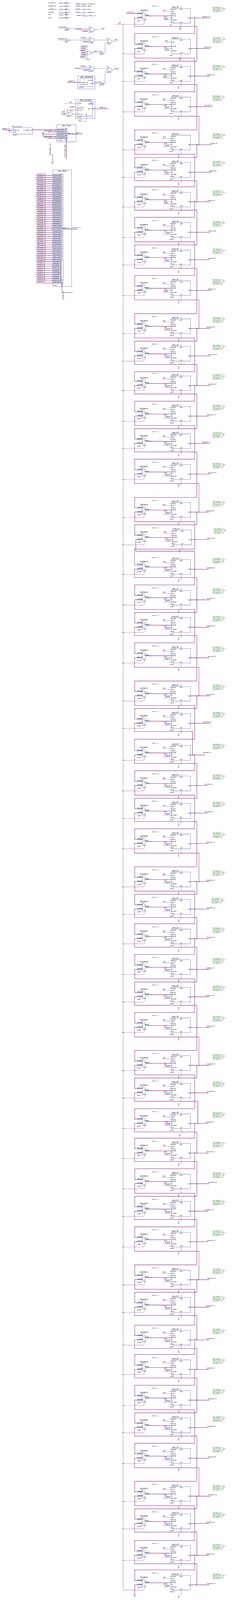
[diagram p0: schematic sheet, whole]
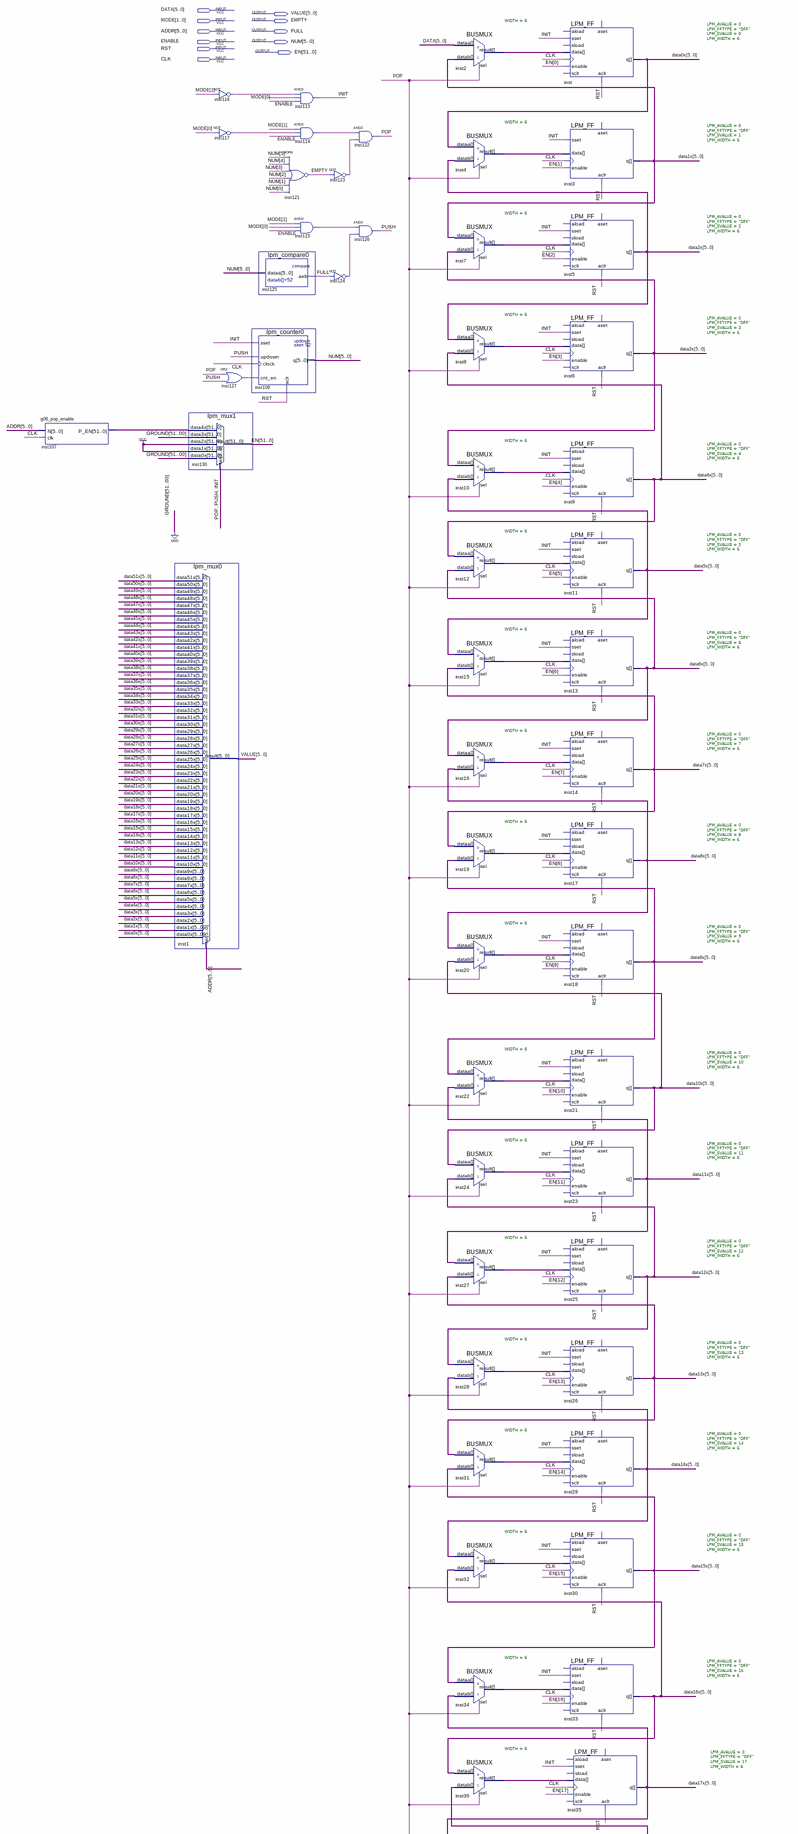
[diagram p1: schematic sheet, upper part]
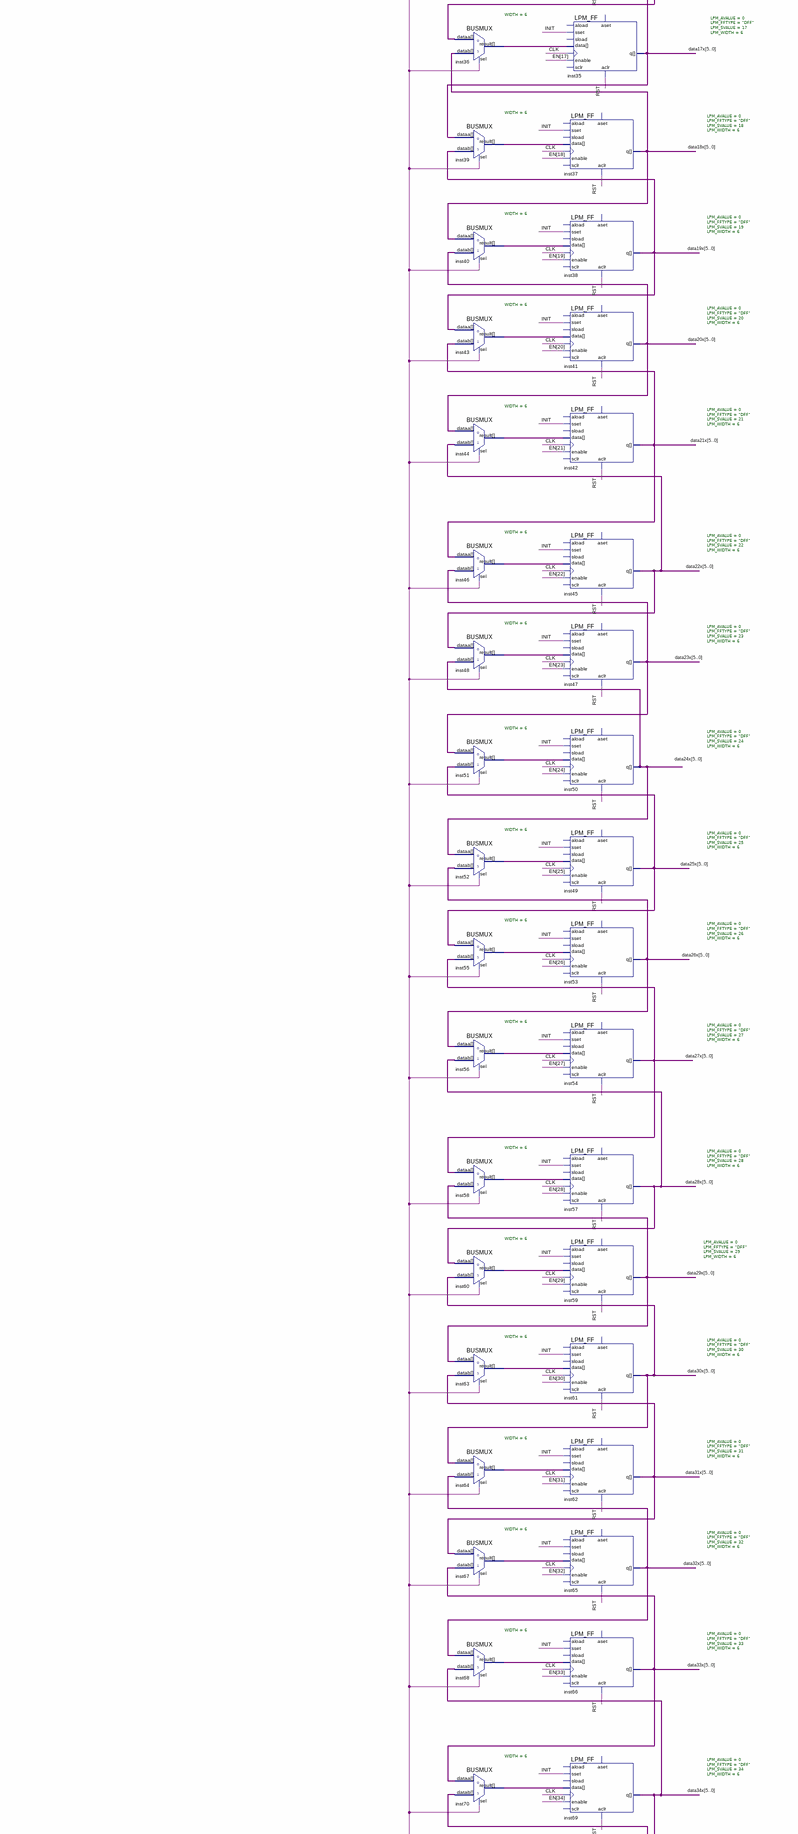
[diagram p2: schematic sheet, middle part]
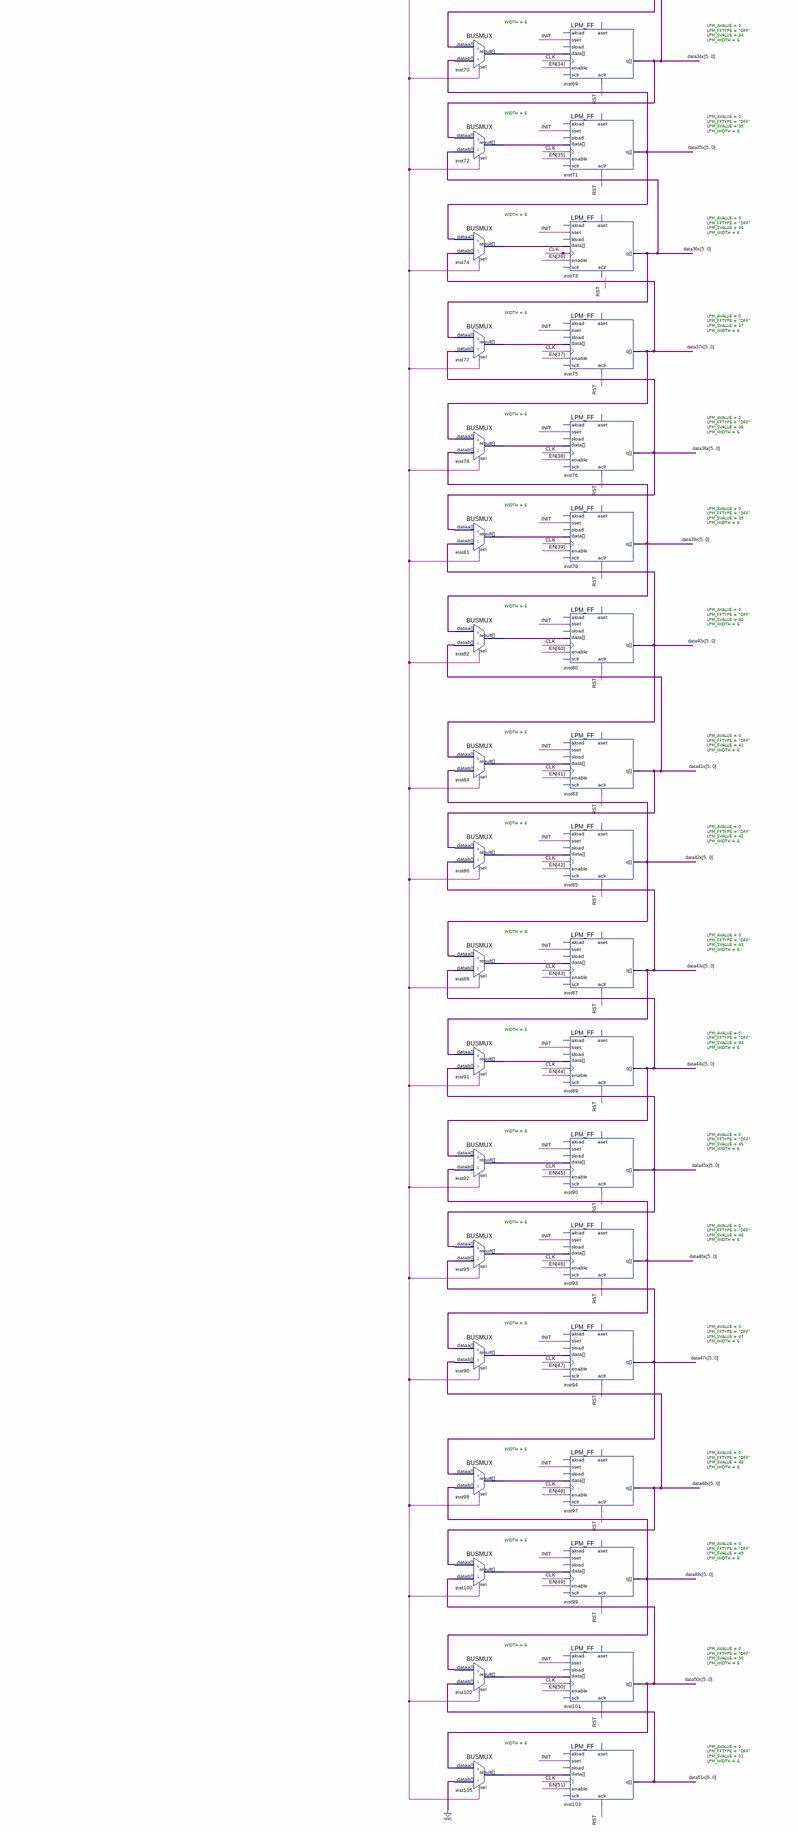
[diagram p3: schematic sheet, lower part]
// Quartus schematic g08_stack52.bdf as structural Verilog: 120 symbols, 11 pins
module g08_stack52 (
  input  [5:0] DATA,
  input  [1:0] MODE,
  input  [5:0] ADDR,
  input  ENABLE,
  input  RST,
  input  CLK,
  output [5:0] VALUE,
  output EMPTY,
  output FULL,
  output [5:0] NUM,
  output [51:0] EN
);

  wire INIT, inst114_out, inst115_out, inst117_out, inst118_out, inst123_out, inst124_out, inst127_out, POP,
       PUSH;
  wire [5:0] data0x, data1x, data2x, data3x, data4x, data5x, data6x, data7x, data8x, data9x, data10x,
       data11x, data12x, data13x, data14x, data15x, data16x, data17x, data18x, data19x, data20x, data21x,
       data22x, data23x, data24x, data25x, data26x, data27x, data28x, data29x, data30x, data31x, data32x,
       data33x, data34x, data35x, data36x, data37x, data38x, data39x, data40x, data41x, data42x, data43x,
       data44x, data45x, data46x, data47x, data48x, data49x, data50x, data51x, inst2_result, inst4_result,
       inst7_result, inst8_result, inst10_result, inst12_result, inst15_result, inst16_result, inst19_result,
       inst20_result, inst22_result, inst24_result, inst27_result, inst28_result, inst31_result,
       inst32_result, inst34_result, inst36_result, inst39_result, inst40_result, inst43_result,
       inst44_result, inst46_result, inst48_result, inst51_result, inst52_result, inst55_result,
       inst56_result, inst58_result, inst60_result, inst63_result, inst64_result, inst67_result,
       inst68_result, inst70_result, inst72_result, inst74_result, inst77_result, inst78_result,
       inst81_result, inst82_result, inst84_result, inst86_result, inst88_result, inst91_result,
       inst92_result, inst95_result, inst96_result, inst98_result, inst100_result, inst102_result,
       inst105_result;
  wire [51:0] inst107_p_en;

  g08_pop_enable inst107 (.N(ADDR), .clk(CLK), .P_EN(inst107_p_en));
  lpm_mux0 inst1 (
    .data51x(data51x), .data50x(data50x), .data49x(data49x), .data48x(data48x), .data47x(data47x),
    .data46x(data46x), .data45x(data45x), .data44x(data44x), .data43x(data43x), .data42x(data42x),
    .data41x(data41x), .data40x(data40x), .data39x(data39x), .data38x(data38x), .data37x(data37x),
    .data36x(data36x), .data35x(data35x), .data34x(data34x), .data33x(data33x), .data32x(data32x),
    .data31x(data31x), .data30x(data30x), .data29x(data29x), .data28x(data28x), .data27x(data27x),
    .data26x(data26x), .data25x(data25x), .data24x(data24x), .data23x(data23x), .data22x(data22x),
    .data21x(data21x), .data20x(data20x), .data19x(data19x), .data18x(data18x), .data17x(data17x),
    .data16x(data16x), .data15x(data15x), .data14x(data14x), .data13x(data13x), .data12x(data12x),
    .data11x(data11x), .data10x(data10x), .data9x(data9x), .data8x(data8x), .data7x(data7x), .data6x(data6x),
    .data5x(data5x), .data4x(data4x), .data3x(data3x), .data2x(data2x), .data1x(data1x), .data0x(data0x),
    .sel(ADDR), .result(VALUE));
  lpm_mux1 inst130 (
    .data4x(inst107_p_en), .data3x({52{1'b0}}), .data2x({52{1'b1}}), .data1x({52{1'b1}}),
    .data0x({52{1'b0}}), .sel({POP, PUSH, INIT}), .result(EN));
  not inst118 (inst118_out, MODE[1]);
  not inst117 (inst117_out, MODE[0]);
  or inst127 (inst127_out, POP, PUSH);
  lpm_compare0 inst125 (.dataa(NUM), .aeb(FULL));
  lpm_counter0 inst108 (.sset(INIT), .updown(PUSH), .clock(CLK), .cnt_en(inst127_out), .aclr(RST), .q(NUM));
  nor inst121 (EMPTY, NUM[5], NUM[4], NUM[3], NUM[2], NUM[1], NUM[0]);
  and inst113 (INIT, inst118_out, MODE[0], ENABLE);
  and inst114 (inst114_out, MODE[1], inst117_out, ENABLE);
  and inst115 (inst115_out, MODE[1], MODE[0], ENABLE);
  not inst123 (inst123_out, EMPTY);
  not inst124 (inst124_out, FULL);
  and inst122 (POP, inst114_out, inst123_out);
  and inst126 (PUSH, inst115_out, inst124_out);
  BUSMUX #(.WIDTH(6)) inst2 (.datab(data1x), .sel(POP), .dataa(DATA), .result(inst2_result));
  BUSMUX #(.WIDTH(6)) inst4 (.datab(data2x), .sel(POP), .dataa(data0x), .result(inst4_result));
  BUSMUX #(.WIDTH(6)) inst7 (.datab(data3x), .sel(POP), .dataa(data1x), .result(inst7_result));
  BUSMUX #(.WIDTH(6)) inst8 (.datab(data4x), .sel(POP), .dataa(data2x), .result(inst8_result));
  BUSMUX #(.WIDTH(6)) inst10 (.datab(data5x), .sel(POP), .dataa(data3x), .result(inst10_result));
  BUSMUX #(.WIDTH(6)) inst12 (.datab(data6x), .sel(POP), .dataa(data4x), .result(inst12_result));
  BUSMUX #(.WIDTH(6)) inst15 (.datab(data7x), .sel(POP), .dataa(data5x), .result(inst15_result));
  BUSMUX #(.WIDTH(6)) inst16 (.datab(data8x), .sel(POP), .dataa(data6x), .result(inst16_result));
  BUSMUX #(.WIDTH(6)) inst19 (.datab(data9x), .sel(POP), .dataa(data7x), .result(inst19_result));
  BUSMUX #(.WIDTH(6)) inst20 (.datab(data10x), .sel(POP), .dataa(data8x), .result(inst20_result));
  BUSMUX #(.WIDTH(6)) inst22 (.datab(data11x), .sel(POP), .dataa(data9x), .result(inst22_result));
  BUSMUX #(.WIDTH(6)) inst24 (.datab(data12x), .sel(POP), .dataa(data10x), .result(inst24_result));
  BUSMUX #(.WIDTH(6)) inst27 (.datab(data13x), .sel(POP), .dataa(data11x), .result(inst27_result));
  BUSMUX #(.WIDTH(6)) inst28 (.datab(data14x), .sel(POP), .dataa(data12x), .result(inst28_result));
  BUSMUX #(.WIDTH(6)) inst31 (.datab(data15x), .sel(POP), .dataa(data13x), .result(inst31_result));
  BUSMUX #(.WIDTH(6)) inst32 (.datab(data16x), .sel(POP), .dataa(data14x), .result(inst32_result));
  BUSMUX #(.WIDTH(6)) inst34 (.datab(data17x), .sel(POP), .dataa(data15x), .result(inst34_result));
  BUSMUX #(.WIDTH(6)) inst36 (.datab(data18x), .sel(POP), .dataa(data16x), .result(inst36_result));
  BUSMUX #(.WIDTH(6)) inst39 (.datab(data19x), .sel(POP), .dataa(data17x), .result(inst39_result));
  BUSMUX #(.WIDTH(6)) inst40 (.datab(data20x), .sel(POP), .dataa(data18x), .result(inst40_result));
  BUSMUX #(.WIDTH(6)) inst43 (.datab(data21x), .sel(POP), .dataa(data19x), .result(inst43_result));
  BUSMUX #(.WIDTH(6)) inst44 (.datab(data22x), .sel(POP), .dataa(data20x), .result(inst44_result));
  BUSMUX #(.WIDTH(6)) inst46 (.datab(data23x), .sel(POP), .dataa(data21x), .result(inst46_result));
  BUSMUX #(.WIDTH(6)) inst48 (.datab(data24x), .sel(POP), .dataa(data22x), .result(inst48_result));
  BUSMUX #(.WIDTH(6)) inst51 (.datab(data25x), .sel(POP), .dataa(data23x), .result(inst51_result));
  BUSMUX #(.WIDTH(6)) inst52 (.datab(data26x), .sel(POP), .dataa(data24x), .result(inst52_result));
  BUSMUX #(.WIDTH(6)) inst55 (.datab(data27x), .sel(POP), .dataa(data25x), .result(inst55_result));
  BUSMUX #(.WIDTH(6)) inst56 (.datab(data28x), .sel(POP), .dataa(data26x), .result(inst56_result));
  BUSMUX #(.WIDTH(6)) inst58 (.datab(data29x), .sel(POP), .dataa(data27x), .result(inst58_result));
  BUSMUX #(.WIDTH(6)) inst60 (.datab(data30x), .sel(POP), .dataa(data28x), .result(inst60_result));
  BUSMUX #(.WIDTH(6)) inst63 (.datab(data31x), .sel(POP), .dataa(data29x), .result(inst63_result));
  BUSMUX #(.WIDTH(6)) inst64 (.datab(data32x), .sel(POP), .dataa(data30x), .result(inst64_result));
  BUSMUX #(.WIDTH(6)) inst67 (.datab(data33x), .sel(POP), .dataa(data31x), .result(inst67_result));
  BUSMUX #(.WIDTH(6)) inst68 (.datab(data34x), .sel(POP), .dataa(data32x), .result(inst68_result));
  BUSMUX #(.WIDTH(6)) inst70 (.datab(data35x), .sel(POP), .dataa(data33x), .result(inst70_result));
  BUSMUX #(.WIDTH(6)) inst72 (.datab(data36x), .sel(POP), .dataa(data34x), .result(inst72_result));
  BUSMUX #(.WIDTH(6)) inst74 (.datab(data37x), .sel(POP), .dataa(data35x), .result(inst74_result));
  BUSMUX #(.WIDTH(6)) inst77 (.datab(data38x), .sel(POP), .dataa(data36x), .result(inst77_result));
  BUSMUX #(.WIDTH(6)) inst78 (.datab(data39x), .sel(POP), .dataa(data37x), .result(inst78_result));
  BUSMUX #(.WIDTH(6)) inst81 (.datab(data40x), .sel(POP), .dataa(data38x), .result(inst81_result));
  BUSMUX #(.WIDTH(6)) inst82 (.datab(data41x), .sel(POP), .dataa(data39x), .result(inst82_result));
  BUSMUX #(.WIDTH(6)) inst84 (.datab(data42x), .sel(POP), .dataa(data40x), .result(inst84_result));
  BUSMUX #(.WIDTH(6)) inst86 (.datab(data43x), .sel(POP), .dataa(data41x), .result(inst86_result));
  BUSMUX #(.WIDTH(6)) inst88 (.datab(data44x), .sel(POP), .dataa(data42x), .result(inst88_result));
  BUSMUX #(.WIDTH(6)) inst91 (.datab(data45x), .sel(POP), .dataa(data43x), .result(inst91_result));
  BUSMUX #(.WIDTH(6)) inst92 (.datab(data46x), .sel(POP), .dataa(data44x), .result(inst92_result));
  BUSMUX #(.WIDTH(6)) inst95 (.datab(data47x), .sel(POP), .dataa(data45x), .result(inst95_result));
  BUSMUX #(.WIDTH(6)) inst96 (.datab(data48x), .sel(POP), .dataa(data46x), .result(inst96_result));
  BUSMUX #(.WIDTH(6)) inst98 (.datab(data49x), .sel(POP), .dataa(data47x), .result(inst98_result));
  BUSMUX #(.WIDTH(6)) inst100 (.datab(data50x), .sel(POP), .dataa(data48x), .result(inst100_result));
  BUSMUX #(.WIDTH(6)) inst102 (.datab(data51x), .sel(POP), .dataa(data49x), .result(inst102_result));
  BUSMUX #(.WIDTH(6)) inst105 (.datab({6{1'b0}}), .sel(POP), .dataa(data50x), .result(inst105_result));
  LPM_FF #(.LPM_AVALUE(0), .LPM_FFTYPE("DFF"), .LPM_SVALUE(0), .LPM_WIDTH(6)) inst (
    .enable(EN[0]), .clock(CLK), .sset(INIT), .aclr(RST), .data(inst2_result), .q(data0x));  // open: aload, sload, aset, sclr
  LPM_FF #(.LPM_AVALUE(0), .LPM_FFTYPE("DFF"), .LPM_SVALUE(1), .LPM_WIDTH(6)) inst3 (
    .aclr(RST), .clock(CLK), .data(inst4_result), .enable(EN[1]), .sset(INIT), .q(data1x));  // open: aset
  LPM_FF #(.LPM_AVALUE(0), .LPM_FFTYPE("DFF"), .LPM_SVALUE(2), .LPM_WIDTH(6)) inst5 (
    .enable(EN[2]), .clock(CLK), .sset(INIT), .aclr(RST), .data(inst7_result), .q(data2x));  // open: aload, sload, aset, sclr
  LPM_FF #(.LPM_AVALUE(0), .LPM_FFTYPE("DFF"), .LPM_SVALUE(3), .LPM_WIDTH(6)) inst6 (
    .enable(EN[3]), .clock(CLK), .sset(INIT), .aclr(RST), .data(inst8_result), .q(data3x));  // open: aload, sload, aset, sclr
  LPM_FF #(.LPM_AVALUE(0), .LPM_FFTYPE("DFF"), .LPM_SVALUE(4), .LPM_WIDTH(6)) inst9 (
    .aclr(RST), .clock(CLK), .data(inst10_result), .enable(EN[4]), .sset(INIT), .q(data4x));  // open: aload, sclr, sload
  LPM_FF #(.LPM_AVALUE(0), .LPM_FFTYPE("DFF"), .LPM_SVALUE(5), .LPM_WIDTH(6)) inst11 (
    .enable(EN[5]), .clock(CLK), .sset(INIT), .aclr(RST), .data(inst12_result), .q(data5x));  // open: aload, sload, aset, sclr
  LPM_FF #(.LPM_AVALUE(0), .LPM_FFTYPE("DFF"), .LPM_SVALUE(6), .LPM_WIDTH(6)) inst13 (
    .enable(EN[6]), .clock(CLK), .sset(INIT), .aclr(RST), .data(inst15_result), .q(data6x));  // open: aload, sload, aset, sclr
  LPM_FF #(.LPM_AVALUE(0), .LPM_FFTYPE("DFF"), .LPM_SVALUE(7), .LPM_WIDTH(6)) inst14 (
    .enable(EN[7]), .clock(CLK), .sset(INIT), .aclr(RST), .data(inst16_result), .q(data7x));  // open: aload, sload, aset, sclr
  LPM_FF #(.LPM_AVALUE(0), .LPM_FFTYPE("DFF"), .LPM_SVALUE(8), .LPM_WIDTH(6)) inst17 (
    .enable(EN[8]), .clock(CLK), .sset(INIT), .aclr(RST), .data(inst19_result), .q(data8x));  // open: aload, sload, aset, sclr
  LPM_FF #(.LPM_AVALUE(0), .LPM_FFTYPE("DFF"), .LPM_SVALUE(9), .LPM_WIDTH(6)) inst18 (
    .enable(EN[9]), .clock(CLK), .sset(INIT), .aclr(RST), .data(inst20_result), .q(data9x));  // open: aload, sload, aset, sclr
  LPM_FF #(.LPM_AVALUE(0), .LPM_FFTYPE("DFF"), .LPM_SVALUE(10), .LPM_WIDTH(6)) inst21 (
    .enable(EN[10]), .clock(CLK), .sset(INIT), .aclr(RST), .data(inst22_result), .q(data10x));  // open: aload, sload, aset, sclr
  LPM_FF #(.LPM_AVALUE(0), .LPM_FFTYPE("DFF"), .LPM_SVALUE(11), .LPM_WIDTH(6)) inst23 (
    .enable(EN[11]), .clock(CLK), .sset(INIT), .aclr(RST), .data(inst24_result), .q(data11x));  // open: aload, sload, aset, sclr
  LPM_FF #(.LPM_AVALUE(0), .LPM_FFTYPE("DFF"), .LPM_SVALUE(12), .LPM_WIDTH(6)) inst25 (
    .enable(EN[12]), .clock(CLK), .sset(INIT), .aclr(RST), .data(inst27_result), .q(data12x));  // open: aload, sload, aset, sclr
  LPM_FF #(.LPM_AVALUE(0), .LPM_FFTYPE("DFF"), .LPM_SVALUE(13), .LPM_WIDTH(6)) inst26 (
    .enable(EN[13]), .clock(CLK), .sset(INIT), .aclr(RST), .data(inst28_result), .q(data13x));  // open: aload, sload, aset, sclr
  LPM_FF #(.LPM_AVALUE(0), .LPM_FFTYPE("DFF"), .LPM_SVALUE(14), .LPM_WIDTH(6)) inst29 (
    .enable(EN[14]), .clock(CLK), .sset(INIT), .aclr(RST), .data(inst31_result), .q(data14x));  // open: aload, sload, aset, sclr
  LPM_FF #(.LPM_AVALUE(0), .LPM_FFTYPE("DFF"), .LPM_SVALUE(15), .LPM_WIDTH(6)) inst30 (
    .enable(EN[15]), .clock(CLK), .sset(INIT), .aclr(RST), .data(inst32_result), .q(data15x));  // open: aload, sload, aset, sclr
  LPM_FF #(.LPM_AVALUE(0), .LPM_FFTYPE("DFF"), .LPM_SVALUE(16), .LPM_WIDTH(6)) inst33 (
    .enable(EN[16]), .clock(CLK), .sset(INIT), .aclr(RST), .data(inst34_result), .q(data16x));  // open: aload, sload, aset, sclr
  LPM_FF #(.LPM_AVALUE(0), .LPM_FFTYPE("DFF"), .LPM_SVALUE(17), .LPM_WIDTH(6)) inst35 (
    .enable(EN[17]), .clock(CLK), .sset(INIT), .aclr(RST), .data(inst36_result), .q(data17x));  // open: aload, sload, aset, sclr
  LPM_FF #(.LPM_AVALUE(0), .LPM_FFTYPE("DFF"), .LPM_SVALUE(18), .LPM_WIDTH(6)) inst37 (
    .enable(EN[18]), .clock(CLK), .sset(INIT), .aclr(RST), .data(inst39_result), .q(data18x));  // open: aload, sload, aset, sclr
  LPM_FF #(.LPM_AVALUE(0), .LPM_FFTYPE("DFF"), .LPM_SVALUE(19), .LPM_WIDTH(6)) inst38 (
    .enable(EN[19]), .clock(CLK), .sset(INIT), .aclr(RST), .data(inst40_result), .q(data19x));  // open: aload, sload, aset, sclr
  LPM_FF #(.LPM_AVALUE(0), .LPM_FFTYPE("DFF"), .LPM_SVALUE(20), .LPM_WIDTH(6)) inst41 (
    .enable(EN[20]), .clock(CLK), .sset(INIT), .aclr(RST), .data(inst43_result), .q(data20x));  // open: aload, sload, aset, sclr
  LPM_FF #(.LPM_AVALUE(0), .LPM_FFTYPE("DFF"), .LPM_SVALUE(21), .LPM_WIDTH(6)) inst42 (
    .enable(EN[21]), .clock(CLK), .sset(INIT), .aclr(RST), .data(inst44_result), .q(data21x));  // open: aload, sload, aset, sclr
  LPM_FF #(.LPM_AVALUE(0), .LPM_FFTYPE("DFF"), .LPM_SVALUE(22), .LPM_WIDTH(6)) inst45 (
    .enable(EN[22]), .clock(CLK), .sset(INIT), .aclr(RST), .data(inst46_result), .q(data22x));  // open: aload, sload, aset, sclr
  LPM_FF #(.LPM_AVALUE(0), .LPM_FFTYPE("DFF"), .LPM_SVALUE(23), .LPM_WIDTH(6)) inst47 (
    .enable(EN[23]), .clock(CLK), .sset(INIT), .aclr(RST), .data(inst48_result), .q(data23x));  // open: aload, sload, aset, sclr
  LPM_FF #(.LPM_AVALUE(0), .LPM_FFTYPE("DFF"), .LPM_SVALUE(24), .LPM_WIDTH(6)) inst50 (
    .enable(EN[24]), .clock(CLK), .sset(INIT), .aclr(RST), .data(inst51_result), .q(data24x));  // open: aload, sload, aset, sclr
  LPM_FF #(.LPM_AVALUE(0), .LPM_FFTYPE("DFF"), .LPM_SVALUE(25), .LPM_WIDTH(6)) inst49 (
    .enable(EN[25]), .clock(CLK), .sset(INIT), .aclr(RST), .data(inst52_result), .q(data25x));  // open: aload, sload, aset, sclr
  LPM_FF #(.LPM_AVALUE(0), .LPM_FFTYPE("DFF"), .LPM_SVALUE(26), .LPM_WIDTH(6)) inst53 (
    .enable(EN[26]), .clock(CLK), .sset(INIT), .aclr(RST), .data(inst55_result), .q(data26x));  // open: aload, sload, aset, sclr
  LPM_FF #(.LPM_AVALUE(0), .LPM_FFTYPE("DFF"), .LPM_SVALUE(27), .LPM_WIDTH(6)) inst54 (
    .enable(EN[27]), .clock(CLK), .sset(INIT), .aclr(RST), .data(inst56_result), .q(data27x));  // open: aload, sload, aset, sclr
  LPM_FF #(.LPM_AVALUE(0), .LPM_FFTYPE("DFF"), .LPM_SVALUE(28), .LPM_WIDTH(6)) inst57 (
    .enable(EN[28]), .clock(CLK), .sset(INIT), .aclr(RST), .data(inst58_result), .q(data28x));  // open: aload, sload, aset, sclr
  LPM_FF #(.LPM_AVALUE(0), .LPM_FFTYPE("DFF"), .LPM_SVALUE(29), .LPM_WIDTH(6)) inst59 (
    .enable(EN[29]), .clock(CLK), .sset(INIT), .aclr(RST), .data(inst60_result), .q(data29x));  // open: aload, sload, aset, sclr
  LPM_FF #(.LPM_AVALUE(0), .LPM_FFTYPE("DFF"), .LPM_SVALUE(30), .LPM_WIDTH(6)) inst61 (
    .enable(EN[30]), .clock(CLK), .sset(INIT), .aclr(RST), .data(inst63_result), .q(data30x));  // open: aload, sload, aset, sclr
  LPM_FF #(.LPM_AVALUE(0), .LPM_FFTYPE("DFF"), .LPM_SVALUE(31), .LPM_WIDTH(6)) inst62 (
    .enable(EN[31]), .clock(CLK), .sset(INIT), .aclr(RST), .data(inst64_result), .q(data31x));  // open: aload, sload, aset, sclr
  LPM_FF #(.LPM_AVALUE(0), .LPM_FFTYPE("DFF"), .LPM_SVALUE(32), .LPM_WIDTH(6)) inst65 (
    .enable(EN[32]), .clock(CLK), .sset(INIT), .aclr(RST), .data(inst67_result), .q(data32x));  // open: aload, sload, aset, sclr
  LPM_FF #(.LPM_AVALUE(0), .LPM_FFTYPE("DFF"), .LPM_SVALUE(33), .LPM_WIDTH(6)) inst66 (
    .enable(EN[33]), .clock(CLK), .sset(INIT), .aclr(RST), .data(inst68_result), .q(data33x));  // open: aload, sload, aset, sclr
  LPM_FF #(.LPM_AVALUE(0), .LPM_FFTYPE("DFF"), .LPM_SVALUE(34), .LPM_WIDTH(6)) inst69 (
    .enable(EN[34]), .clock(CLK), .sset(INIT), .aclr(RST), .data(inst70_result), .q(data34x));  // open: aload, sload, aset, sclr
  LPM_FF #(.LPM_AVALUE(0), .LPM_FFTYPE("DFF"), .LPM_SVALUE(35), .LPM_WIDTH(6)) inst71 (
    .enable(EN[35]), .clock(CLK), .sset(INIT), .aclr(RST), .data(inst72_result), .q(data35x));  // open: aload, sload, aset, sclr
  LPM_FF #(.LPM_AVALUE(0), .LPM_FFTYPE("DFF"), .LPM_SVALUE(36), .LPM_WIDTH(6)) inst73 (
    .enable(EN[36]), .clock(CLK), .sset(INIT), .data(inst74_result), .q(data36x));  // open: aload, sload, aset, sclr, aclr
  LPM_FF #(.LPM_AVALUE(0), .LPM_FFTYPE("DFF"), .LPM_SVALUE(37), .LPM_WIDTH(6)) inst75 (
    .enable(EN[37]), .clock(CLK), .sset(INIT), .aclr(RST), .data(inst77_result), .q(data37x));  // open: aload, sload, aset, sclr
  LPM_FF #(.LPM_AVALUE(0), .LPM_FFTYPE("DFF"), .LPM_SVALUE(38), .LPM_WIDTH(6)) inst76 (
    .enable(EN[38]), .clock(CLK), .sset(INIT), .aclr(RST), .data(inst78_result), .q(data38x));  // open: aload, sload, aset, sclr
  LPM_FF #(.LPM_AVALUE(0), .LPM_FFTYPE("DFF"), .LPM_SVALUE(39), .LPM_WIDTH(6)) inst79 (
    .enable(EN[39]), .clock(CLK), .sset(INIT), .aclr(RST), .data(inst81_result), .q(data39x));  // open: aload, sload, aset, sclr
  LPM_FF #(.LPM_AVALUE(0), .LPM_FFTYPE("DFF"), .LPM_SVALUE(40), .LPM_WIDTH(6)) inst80 (
    .enable(EN[40]), .clock(CLK), .sset(INIT), .aclr(RST), .data(inst82_result), .q(data40x));  // open: aload, sload, aset, sclr
  LPM_FF #(.LPM_AVALUE(0), .LPM_FFTYPE("DFF"), .LPM_SVALUE(41), .LPM_WIDTH(6)) inst83 (
    .enable(EN[41]), .clock(CLK), .sset(INIT), .aclr(RST), .data(inst84_result), .q(data41x));  // open: aload, sload, aset, sclr
  LPM_FF #(.LPM_AVALUE(0), .LPM_FFTYPE("DFF"), .LPM_SVALUE(42), .LPM_WIDTH(6)) inst85 (
    .enable(EN[42]), .clock(CLK), .sset(INIT), .aclr(RST), .data(inst86_result), .q(data42x));  // open: aload, sload, aset, sclr
  LPM_FF #(.LPM_AVALUE(0), .LPM_FFTYPE("DFF"), .LPM_SVALUE(43), .LPM_WIDTH(6)) inst87 (
    .enable(EN[43]), .clock(CLK), .sset(INIT), .aclr(RST), .data(inst88_result), .q(data43x));  // open: aload, sload, aset, sclr
  LPM_FF #(.LPM_AVALUE(0), .LPM_FFTYPE("DFF"), .LPM_SVALUE(44), .LPM_WIDTH(6)) inst89 (
    .enable(EN[44]), .clock(CLK), .sset(INIT), .aclr(RST), .data(inst91_result), .q(data44x));  // open: aload, sload, aset, sclr
  LPM_FF #(.LPM_AVALUE(0), .LPM_FFTYPE("DFF"), .LPM_SVALUE(45), .LPM_WIDTH(6)) inst90 (
    .enable(EN[45]), .clock(CLK), .sset(INIT), .aclr(RST), .data(inst92_result), .q(data45x));  // open: aload, sload, aset, sclr
  LPM_FF #(.LPM_AVALUE(0), .LPM_FFTYPE("DFF"), .LPM_SVALUE(46), .LPM_WIDTH(6)) inst93 (
    .enable(EN[46]), .clock(CLK), .sset(INIT), .aclr(RST), .data(inst95_result), .q(data46x));  // open: aload, sload, aset, sclr
  LPM_FF #(.LPM_AVALUE(0), .LPM_FFTYPE("DFF"), .LPM_SVALUE(47), .LPM_WIDTH(6)) inst94 (
    .enable(EN[47]), .clock(CLK), .sset(INIT), .aclr(RST), .data(inst96_result), .q(data47x));  // open: aload, sload, aset, sclr
  LPM_FF #(.LPM_AVALUE(0), .LPM_FFTYPE("DFF"), .LPM_SVALUE(48), .LPM_WIDTH(6)) inst97 (
    .enable(EN[48]), .clock(CLK), .sset(INIT), .aclr(RST), .data(inst98_result), .q(data48x));  // open: aload, sload, aset, sclr
  LPM_FF #(.LPM_AVALUE(0), .LPM_FFTYPE("DFF"), .LPM_SVALUE(49), .LPM_WIDTH(6)) inst99 (
    .enable(EN[49]), .clock(CLK), .sset(INIT), .aclr(RST), .data(inst100_result), .q(data49x));  // open: aload, sload, aset, sclr
  LPM_FF #(.LPM_AVALUE(0), .LPM_FFTYPE("DFF"), .LPM_SVALUE(50), .LPM_WIDTH(6)) inst101 (
    .enable(EN[50]), .clock(CLK), .sset(INIT), .aclr(RST), .data(inst102_result), .q(data50x));  // open: aload, sload, aset, sclr
  LPM_FF #(.LPM_AVALUE(0), .LPM_FFTYPE("DFF"), .LPM_SVALUE(51), .LPM_WIDTH(6)) inst103 (
    .enable(EN[51]), .clock(CLK), .sset(INIT), .aclr(RST), .data(inst105_result), .q(data51x));  // open: aload, sload, aset, sclr
endmodule
